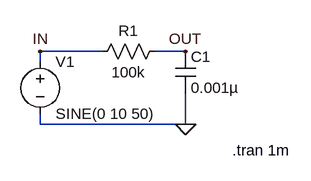
[diagram p0: schematic Draft2.asc]
Draft2.asc, the LTspice schematic file:
Version 4
SHEET 1 1664 1156
WIRE 1344 960 1248 960
WIRE 1472 960 1424 960
WIRE 1248 976 1248 960
WIRE 1248 1072 1248 1056
WIRE 1472 1072 1472 1024
WIRE 1472 1072 1248 1072
FLAG 1472 960 OUT
FLAG 1248 960 IN
FLAG 1472 1072 0
SYMBOL res 1440 944 R90
WINDOW 0 0 56 VBottom 2
WINDOW 3 32 56 VTop 2
SYMATTR InstName R1
SYMATTR Value 100k
SYMBOL cap 1456 960 R0
SYMATTR InstName C1
SYMATTR Value 0.001µ
SYMBOL voltage 1248 960 R0
WINDOW 123 0 0 Left 2
WINDOW 39 0 0 Left 2
SYMATTR InstName V1
SYMATTR Value SINE(0 10 50)
TEXT 1544 1112 Left 2 !.tran 1m

The netlist it stands for:
* Draft2.asc
R1 OUT IN 100k
C1 OUT 0 0.001µ
V1 IN 0 SINE(0 10 50)
.tran 1m
.backanno
.end